# Altium schematic sheet 780-00019 Rev1 Pg1.SchDoc
size C; PageSetup: Record=PageOptions|CenterHorizontal=True|CenterVertical=True|PrintScale=0.70|XCorrection=1.00|YCorrection=1.00|PrintKind=2|BorderSize=5000000|LeftOffset=0|BottomOffset=0|Orientation=2|PaperLength=1000|PaperWidth=1000|Scale=100|PaperSource=7|PrintQuality=-4|MediaType=1|DitherType=10|PaperKind=Tabloid 11 x 17in|PrintScaleMode=1
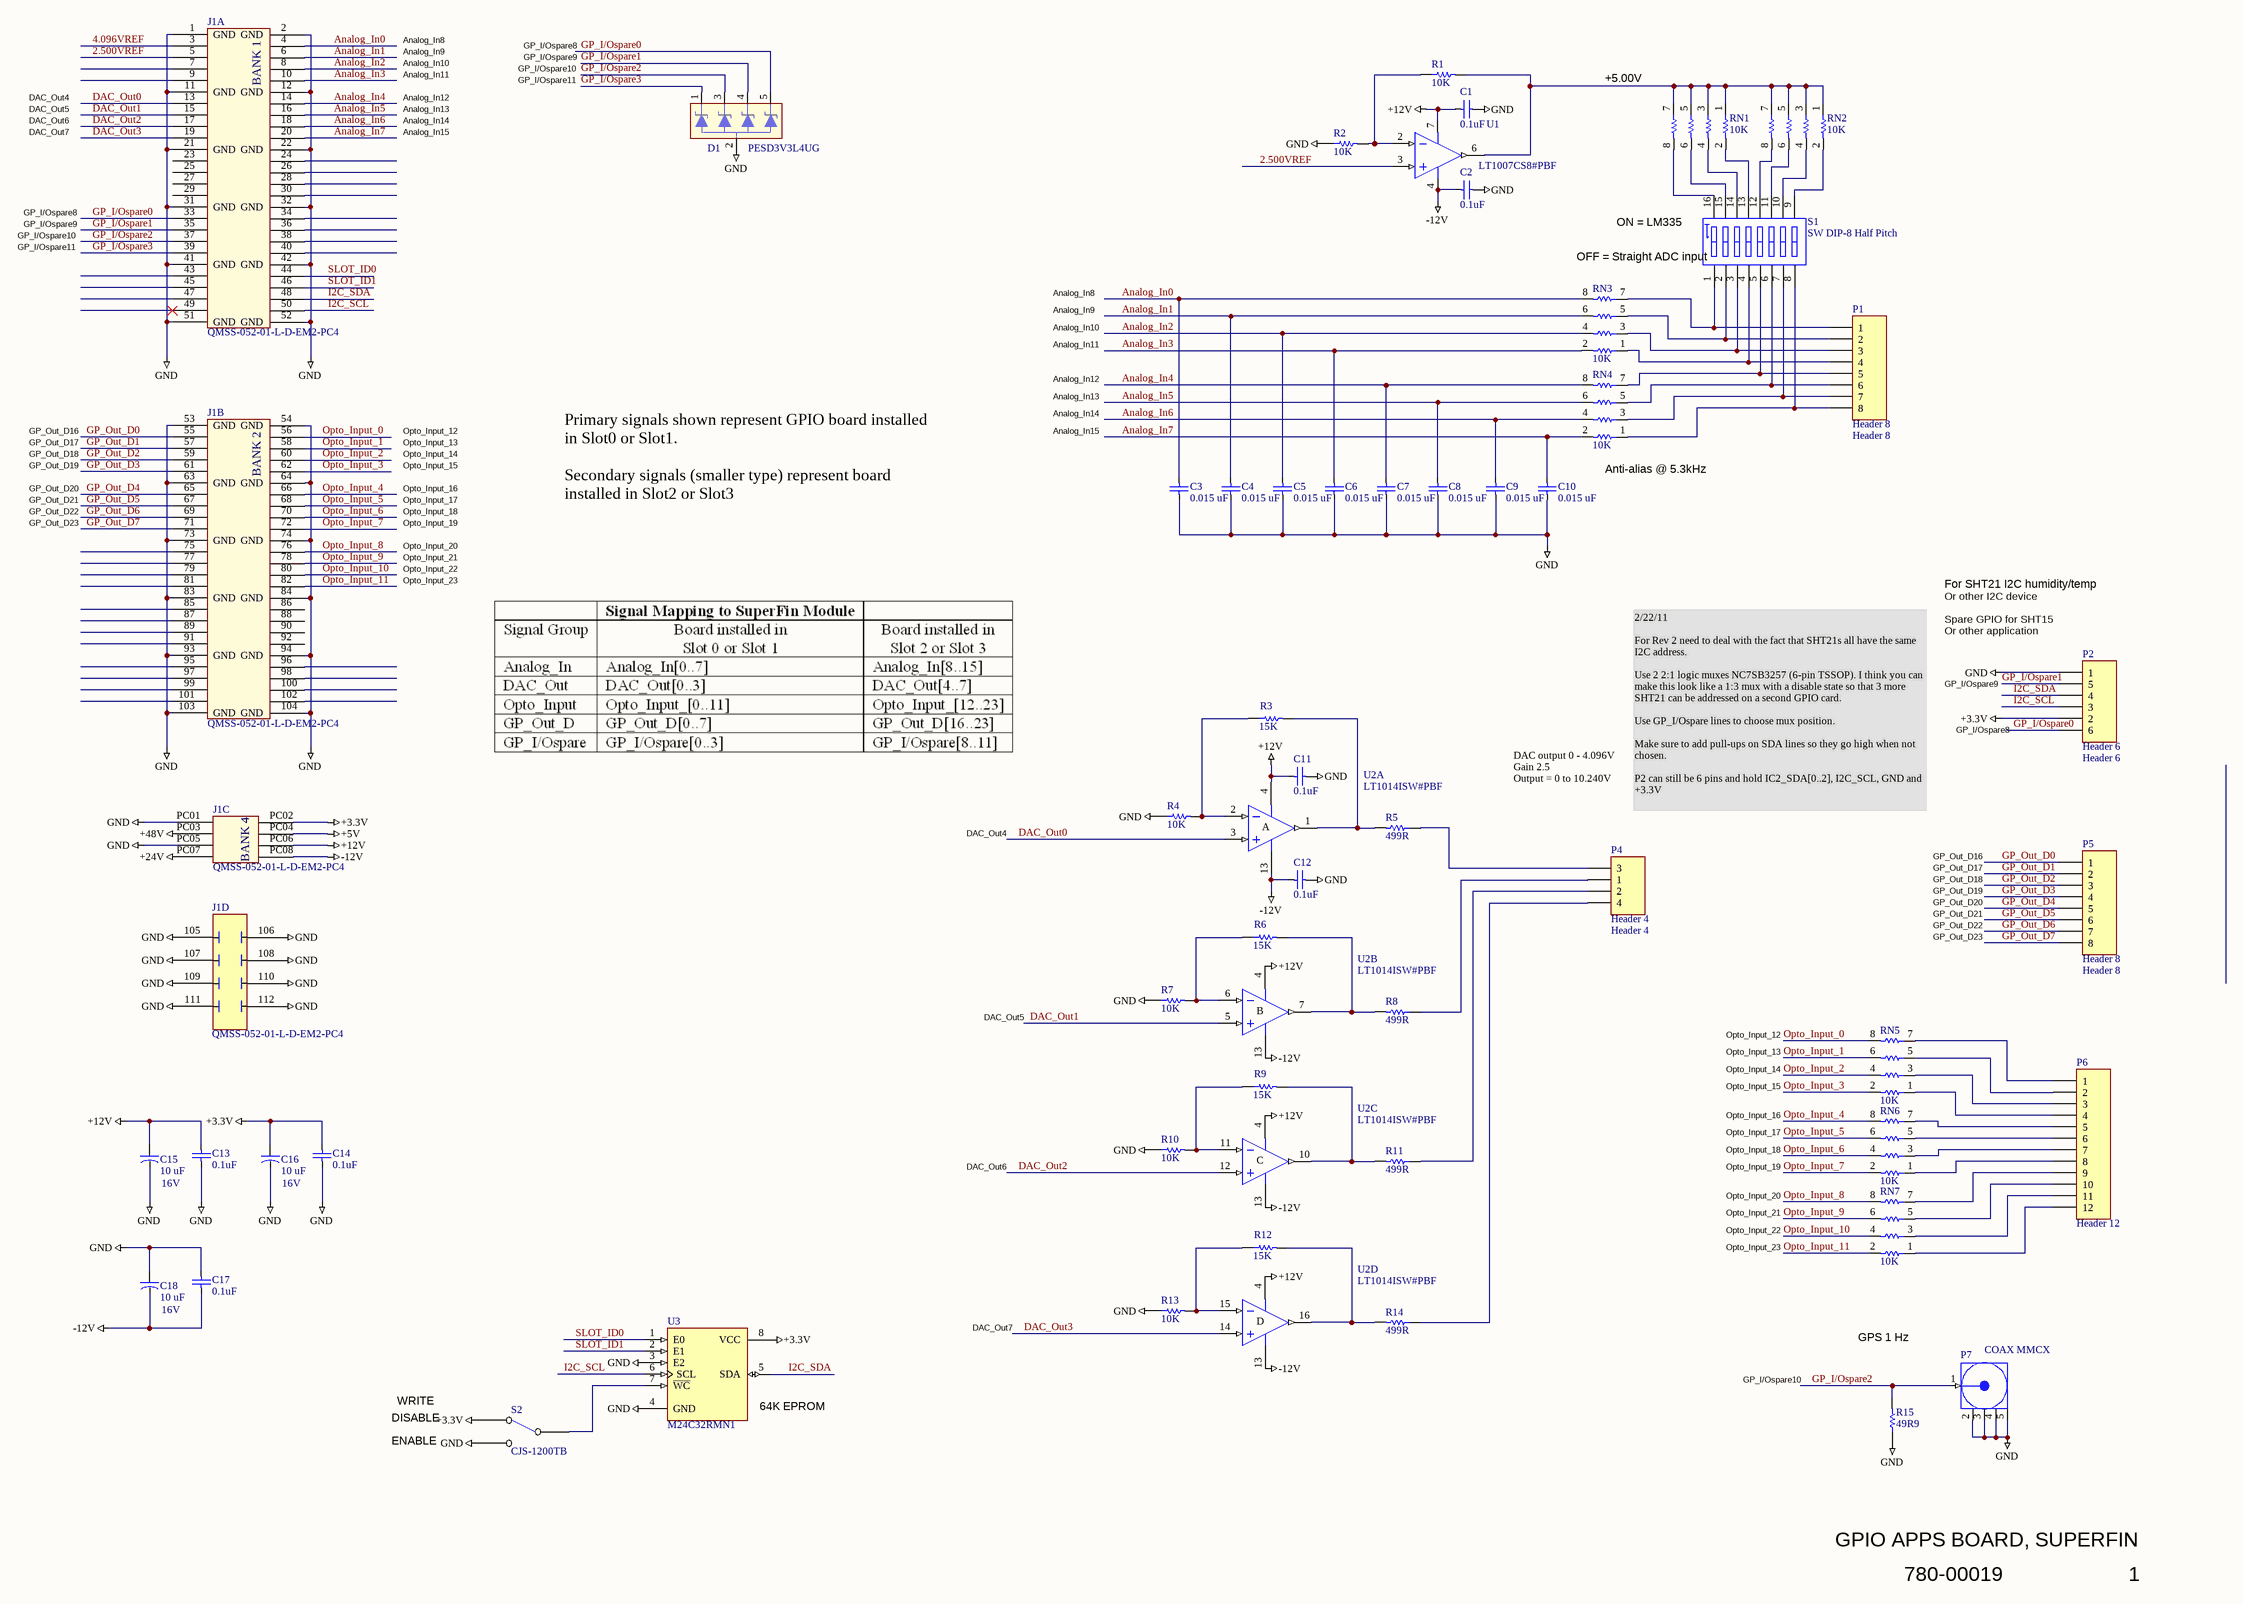
[diagram p0: 780-00019 Rev1 Pg1.SchDoc]

## Parts
C1  value 0.1uF  [SMD_0805]  (hidden comment: Cap SMD)
C2  value 0.1uF  [SMD_0805]  (hidden comment: Cap SMD)
C3  value 0.015 uF  [SMD_0805]  (hidden comment: Cap SMD)
C4  value 0.015 uF  [SMD_0805]  (hidden comment: Cap SMD)
C5  value 0.015 uF  [SMD_0805]  (hidden comment: Cap SMD)
C6  value 0.015 uF  [SMD_0805]  (hidden comment: Cap SMD)
C7  value 0.015 uF  [SMD_0805]  (hidden comment: Cap SMD)
C8  value 0.015 uF  [SMD_0805]  (hidden comment: Cap SMD)
C9  value 0.015 uF  [SMD_0805]  (hidden comment: Cap SMD)
C10  value 0.015 uF  [SMD_0805]  (hidden comment: Cap SMD)
C11  value 0.1uF  [SMD_0805]  (hidden comment: Cap SMD)
C12  value 0.1uF  [SMD_0805]  (hidden comment: Cap SMD)
C13  value 0.1uF  [SMD_0805]  (hidden comment: Cap SMD)
C14  value 0.1uF  [SMD_0805]  (hidden comment: Cap SMD)
C15  16V  value 10 uF  [SMD_CAP_3216]
C16  16V  value 10 uF  [SMD_CAP_3216]
C17  value 0.1uF  [SMD_0805]  (hidden comment: Cap SMD)
C18  16V  value 10 uF  [SMD_CAP_3216]
D1  PESD3V3L4UG  [SOT-353]
J1  value QMSS-052-01-L-D-EM2-PC4  [QMS EDGE PWR PINS - 104 pin]  (hidden comment: QMSS-EM-PC4-104pin)  (parts A,B,C,D of 4)
P1  Header 8  [HDR1X8 for IDC]
P2  Header 6  [HDR1X6 for IDC]
P4  Header 4  [HDR1X4 for IDC]
P5  Header 8  [HDR1X8 for IDC]
P6  Header 12  [HDR1X12 for IDC]
P7  COAX MMCX  [MMCX2.54-V5]
R1  value 10K  [SMD_0805]  (hidden comment: Res 0805)
R2  value 10K  [SMD_0805]  (hidden comment: Res 0805)
R3  value 15K  [SMD_0805]  (hidden comment: Res 0805)
R4  value 10K  [SMD_0805]  (hidden comment: Res 0805)
R5  value 499R  [SMD_0805]  (hidden comment: Res 0805)
R6  value 15K  [SMD_0805]  (hidden comment: Res 0805)
R7  value 10K  [SMD_0805]  (hidden comment: Res 0805)
R8  value 499R  [SMD_0805]  (hidden comment: Res 0805)
R9  value 15K  [SMD_0805]  (hidden comment: Res 0805)
R10  value 10K  [SMD_0805]  (hidden comment: Res 0805)
R11  value 499R  [SMD_0805]  (hidden comment: Res 0805)
R12  value 15K  [SMD_0805]  (hidden comment: Res 0805)
R13  value 10K  [SMD_0805]  (hidden comment: Res 0805)
R14  value 499R  [SMD_0805]  (hidden comment: Res 0805)
R15  value 49R9  [SMD_0805]  (hidden comment: Res 0805)
RN1  value 10K  [RES ARRAY 0603 x 4]  (hidden comment: RES ARRAY  x4 10K)
RN2  value 10K  [RES ARRAY 0603 x 4]  (hidden comment: RES ARRAY  x4 10K)
RN3  value 10K  [RES ARRAY 0603 x 4]  (hidden comment: RES ARRAY  x4 10K)
RN4  value 10K  [RES ARRAY 0603 x 4]  (hidden comment: RES ARRAY  x4 10K)
RN5  value 10K  [RES ARRAY 0603 x 4]  (hidden comment: RES ARRAY  x4 10K)
RN6  value 10K  [RES ARRAY 0603 x 4]  (hidden comment: RES ARRAY  x4 10K)
RN7  value 10K  [RES ARRAY 0603 x 4]  (hidden comment: RES ARRAY  x4 10K)
S1  SW DIP-8 Half Pitch  [SW DIP 8 pos half pitch]
S2  CJS-1200TB  [CAS-120B]
U1  LT1007CS8#PBF  [S8_M]
U2  LT1014ISW#PBF  [SW16_N]  (parts A,B,C,D of 4)
U3  M24C32RMN1  [SOP8_N]

## Nets
+3.3V: C14.1 C16.1 J1.PC02 P2.2 S2.3(NC) U3.8(VCC)
+5V: J1.PC04
+12V: C1.1 C11.1 C13.1 C15.1 J1.PC06 U1.7(V+) U2.4(V+)
+24V: J1.PC07
+48V: J1.PC03
-12V: C2.1 C12.1 C17.2 C18.2 J1.PC08 U1.4(V-) U2.13(V-)
GND: C1.2 C2.2 C3.1 C4.1 C5.1 C6.1 C7.1 C8.1 C9.1 C10.1 C11.2 C12.2 C13.2 C14.2 C15.2 C16.2 C17.1 C18.1 D1.2 J1.1(GND) J1.2(GND) J1.11(GND) J1.12(GND) J1.21(GND) J1.22(GND) J1.31(GND) J1.32(GND) J1.41(GND) J1.42(GND) J1.51(GND) J1.52(GND) J1.53(GND) J1.54(GND) J1.63(GND) J1.64(GND) J1.73(GND) J1.74(GND) J1.83(GND) J1.84(GND) J1.93(GND) J1.94(GND) J1.103(GND) J1.104(GND) J1.105(GND) J1.106(GND) J1.107(GND) J1.108(GND) J1.109(GND) J1.110(GND) J1.111(GND) J1.112(GND) J1.PC01 J1.PC05 P2.1 P7.2(GND) P7.3(GND) P7.4(GND) P7.5(GND) R2.1 R4.1 R7.1 R10.1 R13.1 R15.1 S2.1(NO) U3.3(E2) U3.4(GND)
2.500VREF: J1.5 U1.3(IN+)
4.096VREF: J1.3
Analog_In0: C3.2 J1.4 RN3.8
Analog_In1: C4.2 J1.6 RN3.6
Analog_In2: C5.2 J1.8 RN3.4
Analog_In3: C6.2 J1.10 RN3.2
Analog_In4: C7.2 J1.14 RN4.8
Analog_In5: C8.2 J1.16 RN4.6
Analog_In6: C9.2 J1.18 RN4.4
Analog_In7: C10.2 J1.20 RN4.2
DAC_Out0: J1.13 U2.3(IN+)
DAC_Out1: J1.15 U2.5(IN+)
DAC_Out2: J1.17 U2.12(IN+)
DAC_Out3: J1.19 U2.14(IN+)
GP_I/Ospare0: D1.5 J1.33 P2.6
GP_I/Ospare1: D1.4 J1.35 P2.5
GP_I/Ospare2: D1.3 J1.37 P7.1(Signal) R15.2
GP_I/Ospare3: D1.1 J1.39
GP_Out_D0: J1.55 P5.1
GP_Out_D1: J1.57 P5.2
GP_Out_D2: J1.59 P5.3
GP_Out_D3: J1.61 P5.4
GP_Out_D4: J1.65 P5.5
GP_Out_D5: J1.67 P5.6
GP_Out_D6: J1.69 P5.7
GP_Out_D7: J1.71 P5.8
I2C_SCL: J1.50 P2.3 U3.6(SCL)
I2C_SDA: J1.48 P2.4 U3.5(SDA)
Opto_Input_0: J1.56 RN5.8
Opto_Input_1: J1.58 RN5.6
Opto_Input_2: J1.60 RN5.4
Opto_Input_3: J1.62 RN5.2
Opto_Input_4: J1.66 RN6.8
Opto_Input_5: J1.68 RN6.6
Opto_Input_6: J1.70 RN6.4
Opto_Input_7: J1.72 RN6.2
Opto_Input_8: J1.76 RN7.8
Opto_Input_9: J1.78 RN7.6
Opto_Input_10: J1.80 RN7.4
Opto_Input_11: J1.82 RN7.2
SLOT_ID0: J1.44 U3.1(E0)
SLOT_ID1: J1.46 U3.2(E1)
NetP1_1: P1.1 RN3.7 S1.1(A1)
NetP1_2: P1.2 RN3.5 S1.2(A2)
NetP1_3: P1.3 RN3.3 S1.3(A3)
NetP1_4: P1.4 RN3.1 S1.4(A4)
NetP1_5: P1.5 RN4.7 S1.5(A5)
NetP1_6: P1.6 RN4.5 S1.6(A6)
NetP1_7: P1.7 RN4.3 S1.7(A7)
NetP1_8: P1.8 RN4.1 S1.8(A8)
NetP4_1: P4.1 R8.1
NetP4_2: P4.2 R11.1
NetP4_3: P4.3 R5.1
NetP4_4: P4.4 R14.1
NetP6_1: P6.1 RN5.7
NetP6_2: P6.2 RN5.5
NetP6_3: P6.3 RN5.3
NetP6_4: P6.4 RN5.1
NetP6_5: P6.5 RN6.7
NetP6_6: P6.6 RN6.5
NetP6_7: P6.7 RN6.3
NetP6_8: P6.8 RN6.1
NetP6_9: P6.9 RN7.7
NetP6_10: P6.10 RN7.5
NetP6_11: P6.11 RN7.3
NetP6_12: P6.12 RN7.1
NetR1_1: R1.1 R2.2 U1.2(IN-)
NetR1_2: R1.2 RN1.1 RN1.3 RN1.5 RN1.7 RN2.1 RN2.3 RN2.5 RN2.7 U1.6(OUT)
NetR3_1: R3.1 R4.2 U2.2(IN-)
NetR3_2: R3.2 R5.2 U2.1(OUT)
NetR6_1: R6.1 R7.2 U2.6(IN-)
NetR6_2: R6.2 R8.2 U2.7(OUT)
NetR9_1: R9.1 R10.2 U2.11(IN-)
NetR9_2: R9.2 R11.2 U2.10(OUT)
NetR12_1: R12.1 R13.2 U2.15(IN-)
NetR12_2: R12.2 R14.2 U2.16(OUT)
NetRN1_2: RN1.2 S1.13(B4)
NetRN1_4: RN1.4 S1.14(B3)
NetRN1_6: RN1.6 S1.15(B2)
NetRN1_8: RN1.8 S1.16(B1)
NetRN2_2: RN2.2 S1.9(B8)
NetRN2_4: RN2.4 S1.10(B7)
NetRN2_6: RN2.6 S1.11(B6)
NetRN2_8: RN2.8 S1.12(B5)
NetS2_2: S2.2(COM) U3.7(~{WC})

Not connected (* = marked no-connect by the designer): J1 7 9 23 24 25 26 27 28 29 30 34 36 38 40 43 45 47 49* 75 77 79 81 85 86 87 88 89 90 91 92 95 96 97 98 99 100 101 102; U1 1(VOSTRIM) 5(NC) 8(VOSTRIM)

## Notes on the sheet
- Analog_In9
- Analog_In10
- Analog_In8
- GP_I/Ospare8
- GP_I/Ospare9
- DAC_Out4
- DAC_Out5
- Analog_In11
- Analog_In12
- Analog_In13
- GP_I/Ospare10
- GP_I/Ospare11
- (near RN1) +5.00V
- DAC_Out6
- DAC_Out7
- Analog_In14
- Analog_In15
- (near S1) ON = LM335
- (near S1) OFF = Straight ADC input
- GP_Out_D16
- GP_Out_D17
- GP_Out_D18
- Opto_Input_12
- Opto_Input_13
- Opto_Input_14
- GP_Out_D19
- GP_Out_D20
- GP_Out_D21
- GP_Out_D22
- GP_Out_D23
- Opto_Input_15
- Opto_Input_16
- Opto_Input_17
- Opto_Input_18
- Opto_Input_19
- Primary signals shown represent GPIO board installed in Slot0 or Slot1.
  Secondary signals (smaller type) represent board installed in Slot2 or Slot3
- (near RN4) Anti-alias @ 5.3kHz
- Opto_Input_20
- Opto_Input_21
- Opto_Input_22
- Opto_Input_23
- For SHT21 I2C humidity/temp
- Or other I2C device
- Spare GPIO for SHT15
- Or other application
- DAC output 0 - 4.096V
  Gain 2.5
  Output = 0 to 10.240V
- 2/22/11
  For Rev 2 need to deal with the fact that SHT21s all have the same I2C address.
  Use 2 2:1 logic muxes NC7SB3257 (6-pin TSSOP). I think you can make this look like a 1:3 mux with a disable state so that 3 more SHT21 can be addressed on a second GPIO card.
  Use GP_I/Ospare lines to choose mux position.
  Make sure to add pull-ups on SDA lines so they go high when not chosen.
  P2 can still be 6 pins and hold IC2_SDA[0..2], I2C_SCL, GND and +3.3V
- GPS 1 Hz
- DISABLE
- ENABLE
- WRITE
- (near U3) 64K EPROM
- GPIO APPS BOARD, SUPERFIN
- 780-00019
- 1
- (in symbol LT1014ISW#PBF, part A) A
- (in symbol LT1014ISW#PBF, part B) B
- (in symbol LT1014ISW#PBF, part C) C
- (in symbol LT1014ISW#PBF, part D) D
- (in symbol QMSS-EM-PC4-104pin, part A) BANK 1
- (in symbol QMSS-EM-PC4-104pin, part B) BANK 2
- (in symbol QMSS-EM-PC4-104pin, part C) BANK 4

## Library data of the parts
C1 C2 C11-C14 C17 = Cap SMD: Capacitor; LCO p/n: 120-00002
C3-C10 = Cap SMD: Capacitor NP0; Manufacturer: Murata; Manuf p/n: GRM2195C1H153JA01D; Vendor: digiKey; Vendor p/n: 490-1643-1-ND; Vendor Mult.: 10; LCO p/n: 120-00043; COST: 0.47
C15 C16 C18 = Cap Tant 16V: outline 3.2mm x 1.6mm; Manufacturer: KEMET; Manuf p/n: T494A106M016AT; Vendor: DIGIKEY; Vendor p/n: 399-3824-1-ND; Vendor Mult.: 1; LCO p/n: 120-00001; COST: 0.78
D1 = ESD Diode 3.3V Quad: Quad ESD Diode 3.3V; Manufacturer: NXP; Manuf p/n: PESD3V3L4UG,115; LCO p/n: 140-00011; VALUE: 3V3; Vendor: DigiKey; Vendor Mult.: 1; Vendor p/n: 568-4042-1-ND; COST: 0.52
J1 = QMSS-EM-PC4-104pin: SAMTEC QMSS EDGE W/PWR PINS; Vendor: SAMETC; Vendor Mult.: 1; LCO p/n: 125-00059; Manufacturer: SAMTEC; Manuf p/n: QMSS-052-01-L-D-EM2-PC4; Vendor p/n: QMSS-052-01-L-D-EM2-PC4; COST: 20.00
P1 P5 = Header 8: Header, 8-Pin; LCO p/n: 125-00047; VALUE: Header 8
P2 = Header 6: Header, 6-Pin; LCO p/n: 125-00033; VALUE: Header 6
P4 = Header 4: Header, 4-Pin; LCO p/n: 125-00037; VALUE: Header 4
P6 = Header 12: Header, 12-Pin; Manufacturer: Tyco; Manuf p/n: 1-640456-2; Vendor: Digi-Key; Vendor p/n: A19475-ND; LCO p/n: 125-00055; COST: 0.57; VALUE: Header 12
P7 = COAX-M: RF Coaxial PCB Connector, MMCX; Thru-Hole, Vertical Mount Plug,  50 Ohm Impedance; Manufacturer: Emerson; Manuf p/n: 135-3701-201; Vendor: DigiKey; Vendor p/n: J597-ND; VALUE: COAX-M; Vendor Mult.: 1; LCO p/n: 125-00054; COST: 5.24
R1 R2 R4 R7 R10 R13 = Res SMD: Resistor 0805; Manufacturer: Vishay/Dale; Manuf p/n: CRCW080510KFKEA; Vendor: DIGIKEY; Vendor p/n: 541-10KCCT-ND; Vendor Mult.: 10; LCO p/n: 181-01002; COST: 0.09
R3 R6 R9 R12 = Res SMD: Resistor 0805; Manufacturer: Vishay/Dale; Manuf p/n: CRCW080515KFKEA; Vendor: DIGIKEY; Vendor p/n: 541-15KCCT-ND; Vendor Mult.: 10; LCO p/n: 181-01502; COST: 0.09
R5 R8 R11 R14 = Res SMD: Resistor 0805; Manufacturer: Vishay/Dale; Manuf p/n: CRCW0805499RFKEA; Vendor: DIGIKEY; Vendor p/n: 541-499RCCT-ND; Vendor Mult.: 10; LCO p/n: 181-04990; COST: 0.09
R15 = Res SMD: Resistor 0805; Manufacturer: Vishay/Dale; Manuf p/n: CRCW080549R9FKEA; Vendor: DIGIKEY; Vendor p/n: 541-49R9CCT-ND; Vendor Mult.: 10; LCO p/n: 181-049R9; COST: 0.09
RN1-RN7 = RES ARRAY  x4 10K: Resistor Array 4 Isolated; Manufacturer: PANASONIC - ECG; Manuf p/n: EXB-38V103JV; Vendor: DIGIKEY; Vendor p/n: Y9103CT-ND; Vendor Mult.: 10; LCO p/n: 180-00043; COST: 0.03
S1 = SW DIP-8 Half Pitch: DIP Switch, 8 Position, SPST; Manufacturer: GrayHill; Manuf p/n: 97C08ST; LCO p/n: 185-00011; VALUE: 8 SPST; Vendor: Digi_Key; Vendor Mult.: 1; Vendor p/n: GH1372-ND
S2 = SW_SPDT_DOUG: Manufacturer: Copal Electronics; Manuf p/n: CAS-120TB; Vendor: DIGIKEY; Vendor Mult.: 1; LCO p/n: 185-00010; COST: 1.27; Value: SW_SPDT
U1 = LT1007CS8#PBF: Low Noise BJT input opamp; Manufacturer: Linear Tech; LCO p/n: 150-00067; VALUE: LT1007; Vendor: DigiKey; Vendor Mult.: 1; Vendor p/n: LT1007CS8#PBF-ND; COST: 4.13; Manuf p/n: LT1007CS8#PBF
U2 = LT1014ISW#PBF: Quad Precision Operational Amplifier; Manufacturer: Linear Tech; LCO p/n: 150-00077; VALUE: LT1014; Vendor: DigiKey; Vendor Mult.: 1; Vendor p/n: LT1014ISW#PBF-ND; COST: 10.40; Manuf p/n: LT1014ISW#PBF
U3 = M24C32RMN1: 32 Kbit Serial I²C Bus EEPROM; Manufacturer: ST Micro; Manuf p/n: M24C32-WMN6TP; LCO p/n: 150-00076; VALUE: M24C32; Vendor: DigiKey; Vendor Mult.: 1; Vendor p/n: 497-5027-1-ND; COST: 0.88